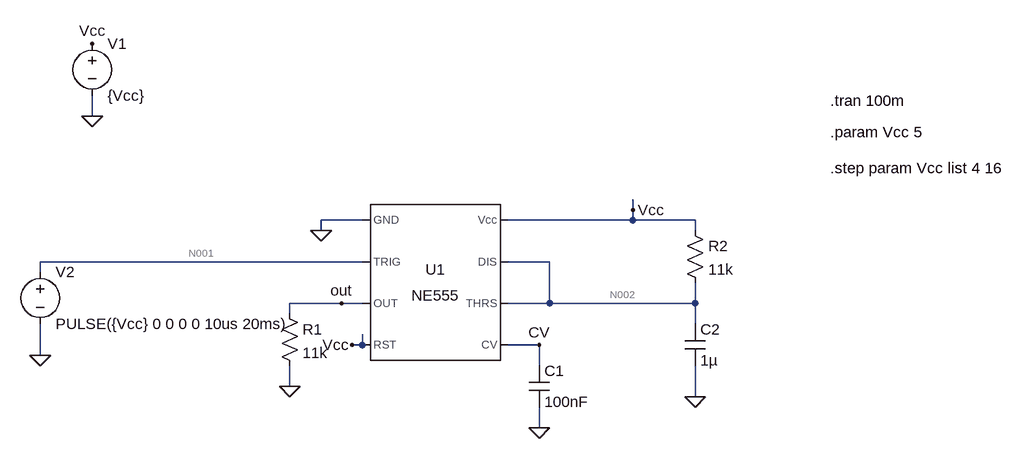
[diagram p0: schematic Timer555.asc]
Timer555.asc, the LTspice schematic file:
Version 4
SHEET 1 1168 680
WIRE -272 -80 -272 -112
WIRE 560 64 560 48
WIRE 144 80 80 80
WIRE 560 80 560 64
WIRE 560 80 368 80
WIRE 656 80 560 80
WIRE 80 96 80 80
WIRE 656 96 656 80
WIRE 144 144 -352 144
WIRE 432 144 368 144
WIRE -352 160 -352 144
WIRE 112 208 32 208
WIRE 144 208 112 208
WIRE 432 208 432 144
WIRE 432 208 368 208
WIRE 656 208 656 176
WIRE 656 208 432 208
WIRE 32 224 32 208
WIRE 656 240 656 208
WIRE 144 272 144 256
WIRE 144 272 128 272
WIRE 416 272 368 272
WIRE -352 288 -352 240
WIRE 416 304 416 272
WIRE 32 336 32 304
WIRE 656 352 656 304
WIRE 416 400 416 368
FLAG 80 96 0
FLAG -272 -192 Vcc
FLAG 32 336 0
FLAG 128 272 Vcc
FLAG 416 400 0
FLAG 656 352 0
FLAG 560 64 Vcc
FLAG -352 288 0
FLAG -272 -80 0
FLAG 112 208 out
FLAG 416 272 CV
SYMBOL Misc\\NE555 256 176 R0
SYMATTR InstName U1
SYMBOL voltage -272 -208 R0
SYMATTR InstName V1
SYMATTR Value {Vcc}
SYMBOL voltage -352 144 R0
WINDOW 123 0 0 Left 2
WINDOW 39 0 0 Left 2
SYMATTR InstName V2
SYMATTR Value PULSE({Vcc} 0 0 0 0 10us 20ms)
SYMBOL res 16 208 R0
SYMATTR InstName R1
SYMATTR Value 11k
SYMBOL cap 400 304 R0
SYMATTR InstName C1
SYMATTR Value 100nF
SYMBOL res 640 80 R0
SYMATTR InstName R2
SYMATTR Value 11k
SYMBOL cap 640 240 R0
SYMATTR InstName C2
SYMATTR Value 1µ
TEXT 864 -104 Left 2 !.tran 100m
TEXT 864 -56 Left 2 !.param Vcc 5
TEXT 864 0 Left 2 !.step param Vcc list 4 16

The netlist it stands for:
* Timer555.asc
XU1 0 N001 out Vcc CV N002 N002 Vcc NE555  ; pins GND TRIG OUT RST CV THRS DIS Vcc
V1 Vcc 0 {Vcc}
V2 N001 0 PULSE({Vcc} 0 0 0 0 10us 20ms)
R1 out 0 11k
C1 CV 0 100nF
R2 Vcc N002 11k
C2 N002 0 1µ
.tran 100m
.param Vcc 5
.step param Vcc list 4 16
.lib NE555.sub
.backanno
.end

* Results of the author's LTspice run, read from the files saved beside the schematic
* Operating Point (first step), zero values left out:
*   vcc = 4 
*   V(n001) = 4 V
*   V(cv) = 2.667 V
*   V(vcc) = 4 V
*   V(n002) = 4 V
*   V(out) = 3.998 V
*   I(R2) = 9.337 nA
*   I(R1) = 363.4 µA
*   I(V2) = -4 nA
*   I(V1) = -1.65 mA
*   Ix(u1:1) = -1.287 mA
*   Ix(u1:2) = 4 nA
*   Ix(u1:3) = -363.4 µA
*   Ix(u1:4) = 16 µA
*   Ix(u1:6) = 4 nA
*   Ix(u1:7) = 5.337 nA
*   Ix(u1:8) = 1.634 mA
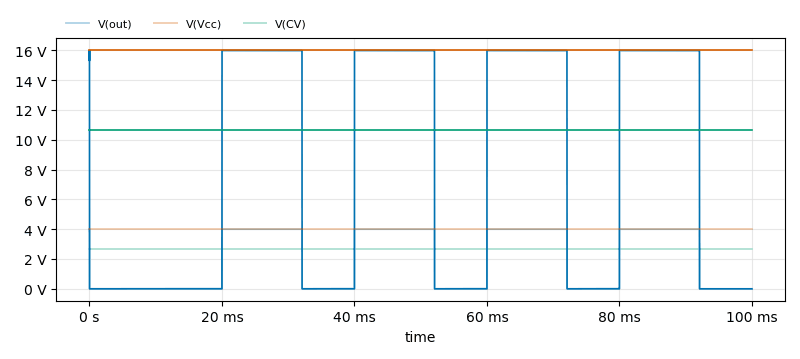
[diagram p1: Transient Analysis of Timer555.asc, plotted from the saved traces]
* Transient Analysis, 2 runs:
*   V(out) [vcc=4]: min 23.99 µV, max 3.998 V, average 1.933 V, rms 2.78 V, last 23.99 µV
*   V(out) [vcc=16]: min 95.95 µV, max 15.99 V, average 7.729 V, rms 11.12 V, last 95.95 µV
*   V(Vcc) [vcc=4]: min 4 V, max 4 V, average 4 V, rms 4 V, last 4 V
*   V(Vcc) [vcc=16]: min 16 V, max 16 V, average 16 V, rms 16 V, last 16 V
*   V(CV) [vcc=4]: min 2.667 V, max 2.667 V, average 2.667 V, rms 2.667 V, last 2.667 V
*   V(CV) [vcc=16]: min 10.67 V, max 10.67 V, average 10.67 V, rms 10.67 V, last 10.67 V